# Altium schematic sheet SAT_GPS_CLOCK_IC.SchDoc
size A; SheetNumber: 2; SheetTotal: 2
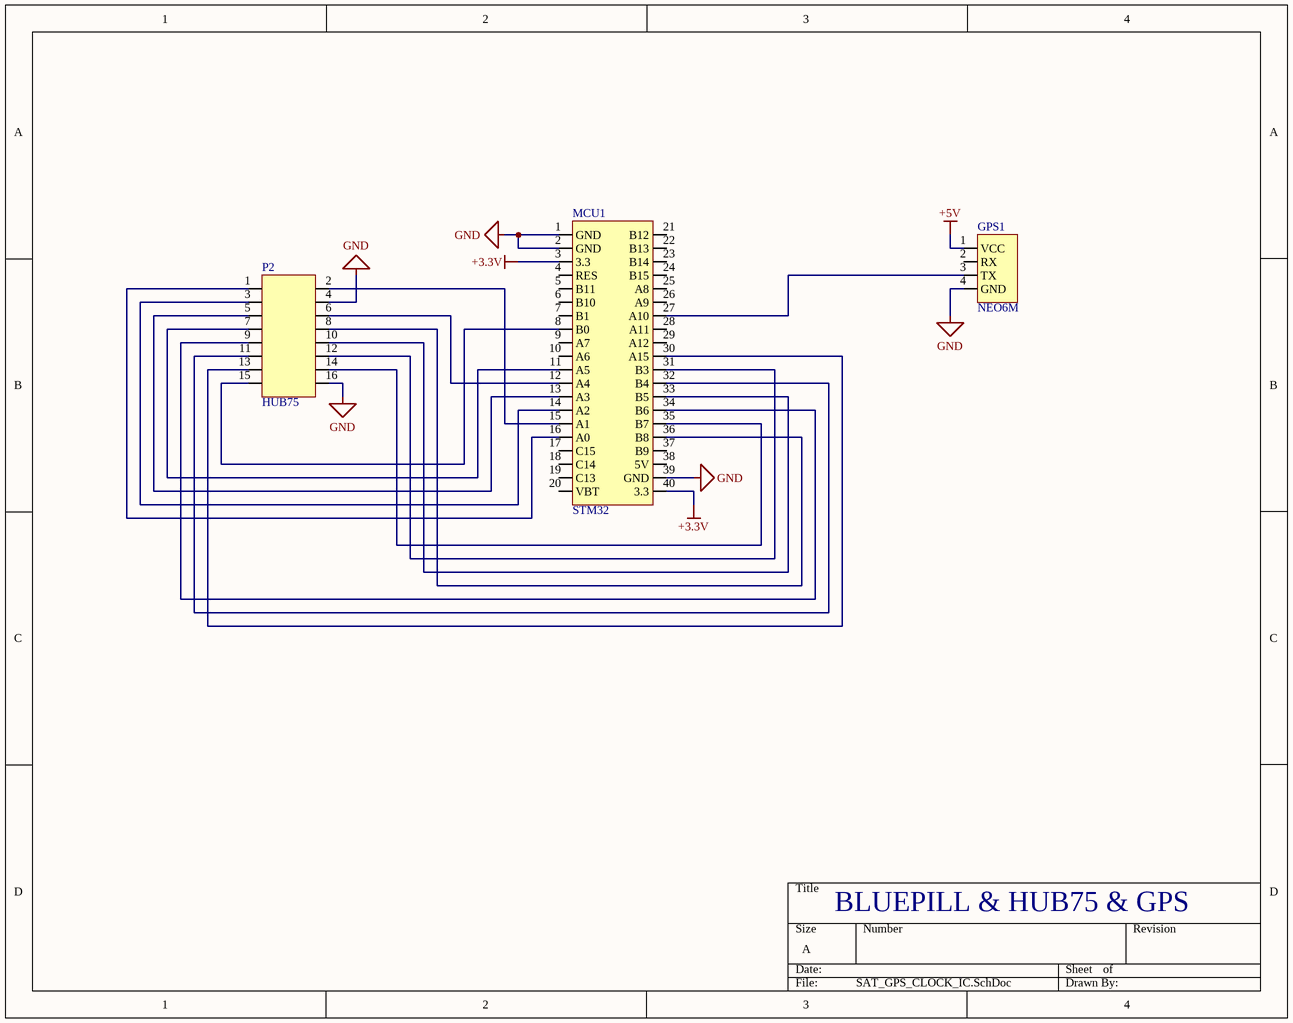
[diagram p0: SAT_GPS_CLOCK_IC.SchDoc]

## Parts
GPS1  NEO6M  [THT_NEO6M_FINAL]
MCU1  STM32  [STM32F103C6T6_THT]
P2  HUB75  [THT_CON_2316S-16G]

## Nets
+3.3V: MCU1.3(3.3) MCU1.40(3.3)
+5V: GPS1.1(VCC)
GND: GPS1.4(GND) MCU1.1(GND) MCU1.2(GND) MCU1.39(GND) P2.4 P2.16
NetGPS1_3: GPS1.3(TX) MCU1.27(A10)
NetMCU1_8: MCU1.8(B0) P2.15
NetMCU1_11: MCU1.11(A5) P2.7
NetMCU1_12: MCU1.12(A4) P2.6
NetMCU1_13: MCU1.13(A3) P2.5
NetMCU1_14: MCU1.14(A2) P2.3
NetMCU1_15: MCU1.15(A1) P2.2
NetMCU1_16: MCU1.16(A0) P2.1
NetMCU1_30: MCU1.30(A15) P2.13
NetMCU1_31: MCU1.31(B3) P2.12
NetMCU1_32: MCU1.32(B4) P2.11
NetMCU1_33: MCU1.33(B5) P2.10
NetMCU1_34: MCU1.34(B6) P2.9
NetMCU1_35: MCU1.35(B7) P2.14
NetMCU1_36: MCU1.36(B8) P2.8

Not connected (* = marked no-connect by the designer): GPS1 2(RX); MCU1 4(RES) 5(B11) 6(B10) 7(B1) 9(A7) 10(A6) 17(C15) 18(C14) 19(C13) 20(VBT) 21(B12) 22(B13) 23(B14) 24(B15) 25(A8) 26(A9) 28(A11) 29(A12) 37(B9) 38(5V)

## Notes on the sheet
- BLUEPILL & HUB75 & GPS

## Library data of the parts
GPS1 = THT_NEO6M_FINAL: GPS Module NEO6M Breakout Board
MCU1 = STM32F103C6T6_THT: STM32F103C8T6 Blue Pill
P2 = THT_CON_2316S-16G: Connector 2316S-16G 16 Pin 2.54 Pitch